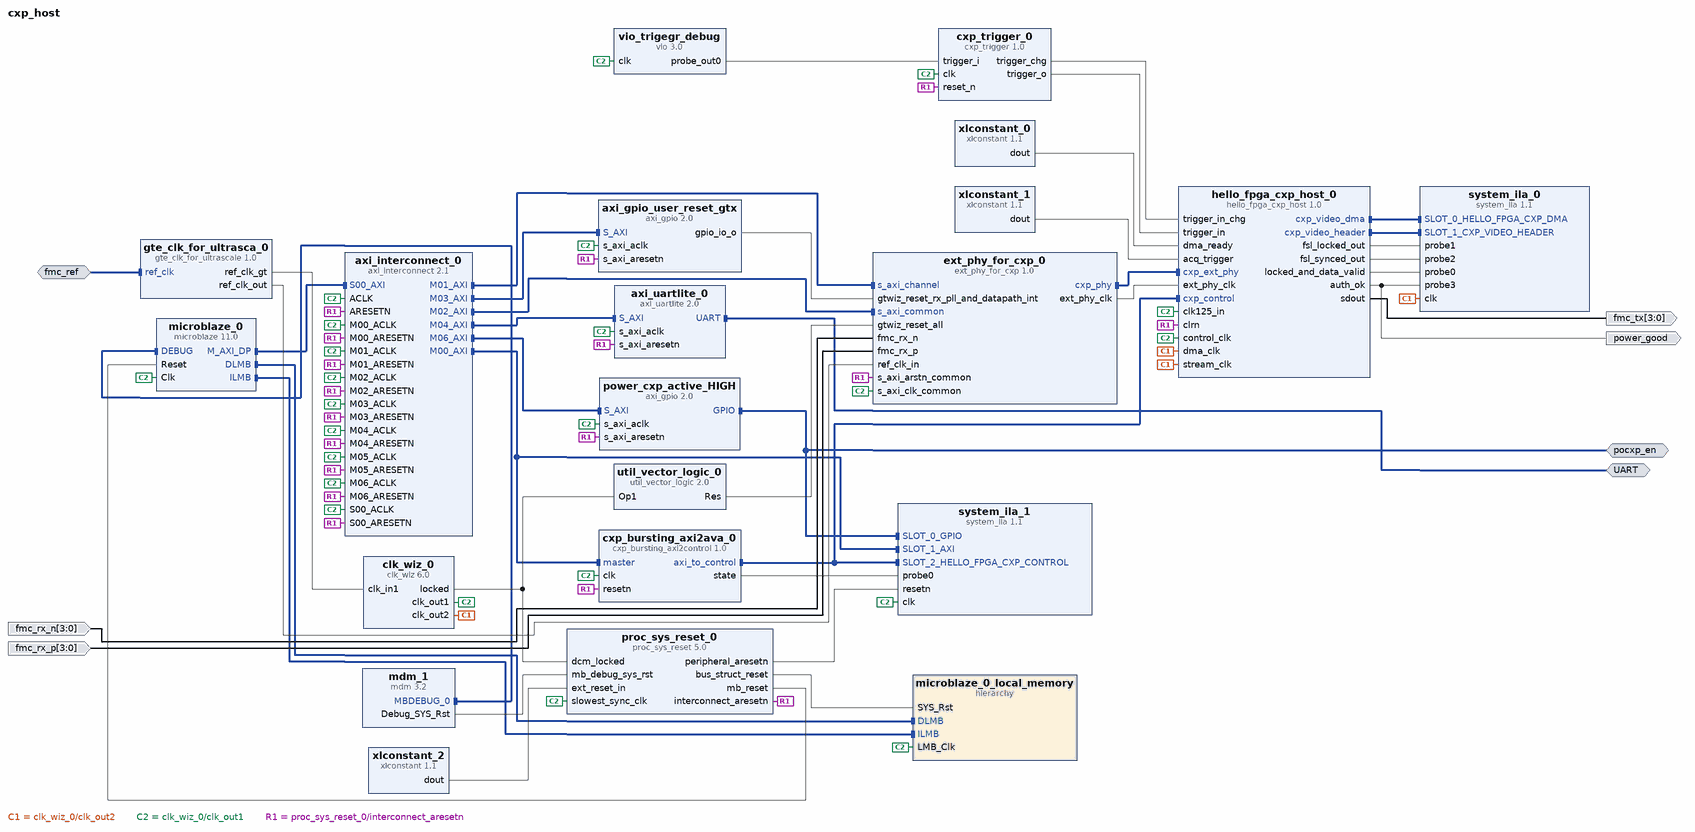
[diagram p0: block diagram of the top level]
# Vivado block design cxp_host, xcku060-ffva1156-2-i, Vivado 2019.1
create_bd_design cxp_host

create_bd_intf_port -mode Master -vlnv xilinx.com:interface:uart_rtl:1.0 UART
create_bd_intf_port -mode Slave -vlnv xilinx.com:interface:diff_clock_rtl:1.0 fmc_ref
create_bd_intf_port -mode Master -vlnv xilinx.com:interface:gpio_rtl:1.0 pocxp_en
create_bd_port -dir I -from 3 -to 0 fmc_rx_n
create_bd_port -dir I -from 3 -to 0 fmc_rx_p
create_bd_port -dir O -from 3 -to 0 fmc_tx
create_bd_port -dir O power_good

create_bd_cell -type hier microblaze_0_local_memory
create_bd_cell -type ip -vlnv xilinx.com:ip:axi_gpio:2.0 axi_gpio_user_reset_gtx
set_property -dict {CONFIG.C_ALL_OUTPUTS 1 CONFIG.C_GPIO_WIDTH 1} [get_bd_cells axi_gpio_user_reset_gtx]
create_bd_cell -type ip -vlnv xilinx.com:ip:axi_interconnect:2.1 axi_interconnect_0
set_property -dict {CONFIG.NUM_MI 7 CONFIG.S00_HAS_DATA_FIFO 0 CONFIG.STRATEGY 0} [get_bd_cells axi_interconnect_0]
create_bd_cell -type ip -vlnv xilinx.com:ip:axi_uartlite:2.0 axi_uartlite_0
set_property -dict [list \
  CONFIG.C_BAUDRATE 115200 \
  CONFIG.C_S_AXI_ACLK_FREQ_HZ 125000000 \
  CONFIG.UARTLITE_BOARD_INTERFACE Custom \
] [get_bd_cells axi_uartlite_0]
create_bd_cell -type ip -vlnv xilinx.com:ip:clk_wiz:6.0 clk_wiz_0
set_property -dict [list \
  CONFIG.CLKIN1_JITTER_PS 80.0 \
  CONFIG.CLKOUT1_JITTER 105.587 \
  CONFIG.CLKOUT1_PHASE_ERROR 83.589 \
  CONFIG.CLKOUT1_REQUESTED_OUT_FREQ 125 \
  CONFIG.CLKOUT2_JITTER 92.841 \
  CONFIG.CLKOUT2_PHASE_ERROR 83.589 \
  CONFIG.CLKOUT2_REQUESTED_OUT_FREQ 250 \
  CONFIG.CLKOUT2_USED true \
  CONFIG.CLKOUT3_JITTER 92.841 \
  CONFIG.CLKOUT3_PHASE_ERROR 83.589 \
  CONFIG.CLKOUT3_REQUESTED_OUT_FREQ 100.000 \
  CONFIG.CLKOUT3_USED false \
  CONFIG.MMCM_CLKFBOUT_MULT_F 8.000 \
  CONFIG.MMCM_CLKIN1_PERIOD 8.000 \
  CONFIG.MMCM_CLKIN2_PERIOD 10.000 \
  CONFIG.MMCM_CLKOUT0_DIVIDE_F 8.000 \
  CONFIG.MMCM_CLKOUT1_DIVIDE 4 \
  CONFIG.MMCM_CLKOUT2_DIVIDE 1 \
  CONFIG.MMCM_DIVCLK_DIVIDE 1 \
  CONFIG.NUM_OUT_CLKS 2 \
  CONFIG.PHASESHIFT_MODE LATENCY \
  CONFIG.PRIM_IN_FREQ 125.000 \
  CONFIG.USE_RESET false \
] [get_bd_cells clk_wiz_0]
create_bd_cell -type ip -vlnv Hello-FPGA:CXP:cxp_bursting_axi2control:1.0 cxp_bursting_axi2ava_0
set_property -dict {CONFIG.ADDRSIZE 16 CONFIG.BURSTSIZE 1 CONFIG.C_S_AXI_BURST_WIDTH 8} [get_bd_cells cxp_bursting_axi2ava_0]
create_bd_cell -type ip -vlnv Hello_FPGA:CXP:cxp_trigger:1.0 cxp_trigger_0
create_bd_cell -type ip -vlnv Hello_FPGA:CXP:gte_clk_for_ultrascale:1.0 gte_clk_for_ultrasca_0
create_bd_cell -type ip -vlnv xilinx.com:ip:mdm:3.2 mdm_1
create_bd_cell -type ip -vlnv xilinx.com:ip:microblaze:11.0 microblaze_0
set_property -dict [list \
  CONFIG.C_ADDR_TAG_BITS 0 \
  CONFIG.C_AREA_OPTIMIZED 0 \
  CONFIG.C_DCACHE_ADDR_TAG 0 \
  CONFIG.C_DEBUG_ENABLED 1 \
  CONFIG.C_D_AXI 1 \
  CONFIG.C_D_LMB 1 \
  CONFIG.C_I_LMB 1 \
  CONFIG.C_USE_BARREL 1 \
  CONFIG.C_USE_HW_MUL 1 \
  CONFIG.C_USE_MSR_INSTR 1 \
  CONFIG.C_USE_PCMP_INSTR 1 \
  CONFIG.C_USE_REORDER_INSTR 0 \
  CONFIG.G_TEMPLATE_LIST 8 \
] [get_bd_cells microblaze_0]
create_bd_cell -type ip -vlnv xilinx.com:ip:axi_gpio:2.0 power_cxp_active_HIGH
set_property -dict [list \
  CONFIG.C_ALL_OUTPUTS 1 \
  CONFIG.C_DOUT_DEFAULT 0x00000007 \
  CONFIG.C_GPIO_WIDTH 3 \
] [get_bd_cells power_cxp_active_HIGH]
create_bd_cell -type ip -vlnv xilinx.com:ip:proc_sys_reset:5.0 proc_sys_reset_0
create_bd_cell -type ip -vlnv xilinx.com:ip:system_ila:1.1 system_ila_0
set_property -dict [list \
  CONFIG.C_MON_TYPE MIX \
  CONFIG.C_NUM_MONITOR_SLOTS 2 \
  CONFIG.C_NUM_OF_PROBES 4 \
  CONFIG.C_SLOT 1 \
  CONFIG.C_SLOT_0_INTF_TYPE visn.intranet:user:hello_fpga_cxp_dma_rtl:1.0 \
  CONFIG.C_SLOT_0_TYPE 0 \
  CONFIG.C_SLOT_1_INTF_TYPE Hello_FPGA:CXP:cxp_video_header_rtl:1.0 \
] [get_bd_cells system_ila_0]
create_bd_cell -type ip -vlnv xilinx.com:ip:system_ila:1.1 system_ila_1
set_property -dict [list \
  CONFIG.C_MON_TYPE MIX \
  CONFIG.C_NUM_MONITOR_SLOTS 3 \
  CONFIG.C_NUM_OF_PROBES 1 \
  CONFIG.C_PROBE0_TYPE 0 \
  CONFIG.C_SLOT_0_INTF_TYPE xilinx.com:interface:gpio_rtl:1.0 \
  CONFIG.C_SLOT_0_TYPE 0 \
  CONFIG.C_SLOT_1_APC_EN 0 \
  CONFIG.C_SLOT_1_AXI_AR_SEL_DATA 1 \
  CONFIG.C_SLOT_1_AXI_AR_SEL_TRIG 1 \
  CONFIG.C_SLOT_1_AXI_AW_SEL_DATA 1 \
  CONFIG.C_SLOT_1_AXI_AW_SEL_TRIG 1 \
  CONFIG.C_SLOT_1_AXI_B_SEL_DATA 1 \
  CONFIG.C_SLOT_1_AXI_B_SEL_TRIG 1 \
  CONFIG.C_SLOT_1_AXI_R_SEL_DATA 1 \
  CONFIG.C_SLOT_1_AXI_R_SEL_TRIG 1 \
  CONFIG.C_SLOT_1_AXI_W_SEL_DATA 1 \
  CONFIG.C_SLOT_1_AXI_W_SEL_TRIG 1 \
  CONFIG.C_SLOT_1_INTF_TYPE xilinx.com:interface:aximm_rtl:1.0 \
  CONFIG.C_SLOT_2_INTF_TYPE visn.intranet:user:hello_fpga_cxp_control_rtl:1.0 \
  CONFIG.C_SLOT_2_TYPE 0 \
] [get_bd_cells system_ila_1]
create_bd_cell -type ip -vlnv xilinx.com:ip:util_vector_logic:2.0 util_vector_logic_0
set_property -dict {CONFIG.C_OPERATION not CONFIG.C_SIZE 1} [get_bd_cells util_vector_logic_0]
create_bd_cell -type ip -vlnv xilinx.com:ip:vio:3.0 vio_trigegr_debug
set_property -dict [list \
  CONFIG.C_NUM_PROBE_IN 0 \
  CONFIG.C_NUM_PROBE_OUT 1 \
  CONFIG.C_PROBE_OUT0_INIT_VAL 0x0 \
] [get_bd_cells vio_trigegr_debug]
create_bd_cell -type ip -vlnv xilinx.com:ip:xlconstant:1.1 xlconstant_0
create_bd_cell -type ip -vlnv xilinx.com:ip:xlconstant:1.1 xlconstant_1
create_bd_cell -type ip -vlnv xilinx.com:ip:xlconstant:1.1 xlconstant_2
create_bd_cell -type ip -vlnv Hello_FPGA:CXP:ext_phy_for_cxp:1.0 ext_phy_for_cxp_0
create_bd_cell -type ip -vlnv Hello_FPGA:CXP:hello_fpga_cxp_host:1.0 hello_fpga_cxp_host_0
set_property -dict [list \
  CONFIG.BIGENDIAN_EN 0 \
  CONFIG.CONTROL_CLK_FREQ 50000000 \
  CONFIG.DEVICE UltraScale \
  CONFIG.ENABLE_DNA_AUTH 0 \
  CONFIG.INDIRECT_REGS 1 \
  CONFIG.REGS_PER_LINK 0 \
  CONFIG.STREAM_BUFFER_BYTES 8192 \
  CONFIG.STREAM_WORDS 8 \
] [get_bd_cells hello_fpga_cxp_host_0]

# ---- hierarchy /microblaze_0_local_memory ----
current_bd_instance /microblaze_0_local_memory
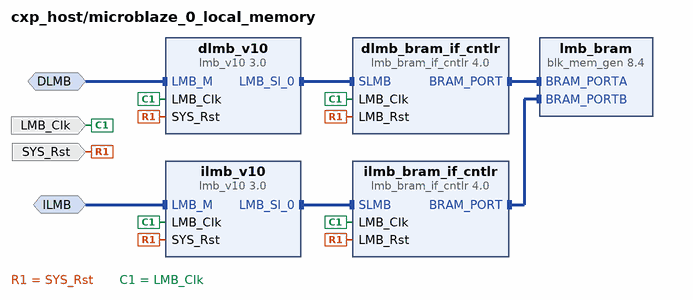
[diagram p1: block diagram inside /microblaze_0_local_memory]
create_bd_intf_pin -mode MirroredMaster -vlnv xilinx.com:interface:lmb_rtl:1.0 DLMB
create_bd_intf_pin -mode MirroredMaster -vlnv xilinx.com:interface:lmb_rtl:1.0 ILMB
create_bd_pin -dir I -type clk LMB_Clk
create_bd_pin -dir I -type rst SYS_Rst

create_bd_cell -type ip -vlnv xilinx.com:ip:lmb_bram_if_cntlr:4.0 dlmb_bram_if_cntlr
set_property -dict {CONFIG.C_ECC 0} [get_bd_cells dlmb_bram_if_cntlr]
create_bd_cell -type ip -vlnv xilinx.com:ip:lmb_v10:3.0 dlmb_v10
create_bd_cell -type ip -vlnv xilinx.com:ip:lmb_bram_if_cntlr:4.0 ilmb_bram_if_cntlr
set_property -dict {CONFIG.C_ECC 0} [get_bd_cells ilmb_bram_if_cntlr]
create_bd_cell -type ip -vlnv xilinx.com:ip:lmb_v10:3.0 ilmb_v10
create_bd_cell -type ip -vlnv xilinx.com:ip:blk_mem_gen:8.4 lmb_bram
set_property -dict [list \
  CONFIG.Enable_B Use_ENB_Pin \
  CONFIG.Memory_Type True_Dual_Port_RAM \
  CONFIG.Port_B_Clock 100 \
  CONFIG.Port_B_Enable_Rate 100 \
  CONFIG.Port_B_Write_Rate 50 \
  CONFIG.Use_RSTB_Pin true \
  CONFIG.use_bram_block BRAM_Controller \
] [get_bd_cells lmb_bram]

# ---- connections ----

current_bd_instance /microblaze_0_local_memory
connect_bd_intf_net -intf_net microblaze_0_dlmb_cntlr [get_bd_intf_pins dlmb_bram_if_cntlr/BRAM_PORT] [get_bd_intf_pins lmb_bram/BRAM_PORTA]
connect_bd_intf_net -intf_net microblaze_0_ilmb [get_bd_intf_pins ILMB] [get_bd_intf_pins ilmb_v10/LMB_M]
connect_bd_intf_net -intf_net microblaze_0_dlmb [get_bd_intf_pins DLMB] [get_bd_intf_pins dlmb_v10/LMB_M]
connect_bd_intf_net -intf_net microblaze_0_dlmb_bus [get_bd_intf_pins dlmb_bram_if_cntlr/SLMB] [get_bd_intf_pins dlmb_v10/LMB_Sl_0]
connect_bd_intf_net -intf_net microblaze_0_ilmb_cntlr [get_bd_intf_pins ilmb_bram_if_cntlr/BRAM_PORT] [get_bd_intf_pins lmb_bram/BRAM_PORTB]
connect_bd_intf_net -intf_net microblaze_0_ilmb_bus [get_bd_intf_pins ilmb_bram_if_cntlr/SLMB] [get_bd_intf_pins ilmb_v10/LMB_Sl_0]
connect_bd_net [get_bd_pins SYS_Rst] \
  [get_bd_pins dlmb_bram_if_cntlr/LMB_Rst] [get_bd_pins dlmb_v10/SYS_Rst] [get_bd_pins ilmb_bram_if_cntlr/LMB_Rst] \
  [get_bd_pins ilmb_v10/SYS_Rst]
connect_bd_net -net microblaze_0_Clk [get_bd_pins LMB_Clk] \
  [get_bd_pins dlmb_bram_if_cntlr/LMB_Clk] [get_bd_pins dlmb_v10/LMB_Clk] [get_bd_pins ilmb_bram_if_cntlr/LMB_Clk] \
  [get_bd_pins ilmb_v10/LMB_Clk]
set_property HDL_ATTRIBUTE.BMM_INFO_ADDRESS_SPACE {byte  0x00000000 32 > cxp_host microblaze_0_local_memory/lmb_bram} [get_bd_cells dlmb_bram_if_cntlr]
set_property HDL_ATTRIBUTE.KEEP_HIERARCHY yes [get_bd_cells dlmb_bram_if_cntlr]

current_bd_instance /
connect_bd_intf_net -intf_net hello_fpga_cxp_host_0_cxp_video_dma [get_bd_intf_pins hello_fpga_cxp_host_0/cxp_video_dma] [get_bd_intf_pins system_ila_0/SLOT_0_HELLO_FPGA_CXP_DMA]
connect_bd_intf_net [get_bd_intf_ports fmc_ref] [get_bd_intf_pins gte_clk_for_ultrasca_0/ref_clk]
connect_bd_intf_net [get_bd_intf_ports UART] [get_bd_intf_pins axi_uartlite_0/UART]
connect_bd_intf_net [get_bd_intf_pins axi_interconnect_0/M06_AXI] [get_bd_intf_pins power_cxp_active_HIGH/S_AXI]
connect_bd_intf_net [get_bd_intf_pins axi_interconnect_0/M01_AXI] [get_bd_intf_pins ext_phy_for_cxp_0/s_axi_channel]
connect_bd_intf_net -intf_net cxp_bursting_axi2ava_0_axi_to_control [get_bd_intf_pins cxp_bursting_axi2ava_0/axi_to_control] [get_bd_intf_pins hello_fpga_cxp_host_0/cxp_control]
connect_bd_intf_net [get_bd_intf_pins cxp_bursting_axi2ava_0/axi_to_control] [get_bd_intf_pins system_ila_1/SLOT_2_HELLO_FPGA_CXP_CONTROL]
connect_bd_intf_net -intf_net ext_phy_for_cxp_1_cxp_phy [get_bd_intf_pins ext_phy_for_cxp_0/cxp_phy] [get_bd_intf_pins hello_fpga_cxp_host_0/cxp_ext_phy]
connect_bd_intf_net [get_bd_intf_pins microblaze_0/DLMB] [get_bd_intf_pins microblaze_0_local_memory/DLMB]
connect_bd_intf_net -intf_net power_cxp_active_low_GPIO [get_bd_intf_ports pocxp_en] [get_bd_intf_pins power_cxp_active_HIGH/GPIO]
connect_bd_intf_net [get_bd_intf_ports pocxp_en] [get_bd_intf_pins system_ila_1/SLOT_0_GPIO]
connect_bd_intf_net [get_bd_intf_pins axi_interconnect_0/M02_AXI] [get_bd_intf_pins ext_phy_for_cxp_0/s_axi_common]
connect_bd_intf_net [get_bd_intf_pins axi_gpio_user_reset_gtx/S_AXI] [get_bd_intf_pins axi_interconnect_0/M03_AXI]
connect_bd_intf_net [get_bd_intf_pins microblaze_0/ILMB] [get_bd_intf_pins microblaze_0_local_memory/ILMB]
connect_bd_intf_net [get_bd_intf_pins mdm_1/MBDEBUG_0] [get_bd_intf_pins microblaze_0/DEBUG]
connect_bd_intf_net [get_bd_intf_pins axi_interconnect_0/S00_AXI] [get_bd_intf_pins microblaze_0/M_AXI_DP]
connect_bd_intf_net [get_bd_intf_pins axi_interconnect_0/M04_AXI] [get_bd_intf_pins axi_uartlite_0/S_AXI]
connect_bd_intf_net -intf_net axi_interconnect_0_M00_AXI [get_bd_intf_pins axi_interconnect_0/M00_AXI] [get_bd_intf_pins cxp_bursting_axi2ava_0/master]
connect_bd_intf_net [get_bd_intf_pins axi_interconnect_0/M00_AXI] [get_bd_intf_pins system_ila_1/SLOT_1_AXI]
connect_bd_intf_net [get_bd_intf_pins hello_fpga_cxp_host_0/cxp_video_header] [get_bd_intf_pins system_ila_0/SLOT_1_CXP_VIDEO_HEADER]
connect_bd_net [get_bd_pins axi_gpio_user_reset_gtx/gpio_io_o] [get_bd_pins ext_phy_for_cxp_0/gtwiz_reset_rx_pll_and_datapath_int]
connect_bd_net [get_bd_pins clk_wiz_0/clk_out2] \
  [get_bd_pins system_ila_0/clk] [get_bd_pins hello_fpga_cxp_host_0/stream_clk] [get_bd_pins hello_fpga_cxp_host_0/dma_clk]
connect_bd_net [get_bd_pins clk_wiz_0/locked] [get_bd_pins proc_sys_reset_0/dcm_locked] [get_bd_pins util_vector_logic_0/Op1]
connect_bd_net [get_bd_pins cxp_trigger_0/trigger_chg] [get_bd_pins hello_fpga_cxp_host_0/trigger_in_chg]
connect_bd_net [get_bd_pins cxp_trigger_0/trigger_o] [get_bd_pins hello_fpga_cxp_host_0/trigger_in]
connect_bd_net -net ext_phy_for_cxp_1_ext_phy_clk [get_bd_pins ext_phy_for_cxp_0/ext_phy_clk] [get_bd_pins hello_fpga_cxp_host_0/ext_phy_clk]
connect_bd_net [get_bd_ports fmc_rx_n] [get_bd_pins ext_phy_for_cxp_0/fmc_rx_n]
connect_bd_net [get_bd_ports fmc_rx_p] [get_bd_pins ext_phy_for_cxp_0/fmc_rx_p]
connect_bd_net [get_bd_pins gte_clk_for_ultrasca_0/ref_clk_gt] [get_bd_pins clk_wiz_0/clk_in1]
connect_bd_net [get_bd_pins gte_clk_for_ultrasca_0/ref_clk_out] [get_bd_pins ext_phy_for_cxp_0/ref_clk_in]
connect_bd_net [get_bd_pins hello_fpga_cxp_host_0/auth_ok] [get_bd_ports power_good] [get_bd_pins system_ila_0/probe3]
connect_bd_net [get_bd_pins hello_fpga_cxp_host_0/fsl_locked_out] [get_bd_pins system_ila_0/probe1]
connect_bd_net [get_bd_pins hello_fpga_cxp_host_0/fsl_synced_out] [get_bd_pins system_ila_0/probe2]
connect_bd_net [get_bd_pins hello_fpga_cxp_host_0/locked_and_data_valid] [get_bd_pins system_ila_0/probe0]
connect_bd_net [get_bd_pins hello_fpga_cxp_host_0/sdout] [get_bd_ports fmc_tx]
connect_bd_net [get_bd_pins mdm_1/Debug_SYS_Rst] [get_bd_pins proc_sys_reset_0/mb_debug_sys_rst]
connect_bd_net -net microblaze_0_Clk [get_bd_pins clk_wiz_0/clk_out1] \
  [get_bd_pins microblaze_0_local_memory/LMB_Clk] [get_bd_pins axi_gpio_user_reset_gtx/s_axi_aclk] \
  [get_bd_pins axi_interconnect_0/ACLK] [get_bd_pins axi_interconnect_0/S00_ACLK] [get_bd_pins axi_interconnect_0/M00_ACLK] \
  [get_bd_pins axi_interconnect_0/M01_ACLK] [get_bd_pins axi_interconnect_0/M02_ACLK] \
  [get_bd_pins axi_interconnect_0/M03_ACLK] [get_bd_pins axi_interconnect_0/M04_ACLK] \
  [get_bd_pins axi_interconnect_0/M05_ACLK] [get_bd_pins axi_interconnect_0/M06_ACLK] [get_bd_pins axi_uartlite_0/s_axi_aclk] \
  [get_bd_pins cxp_bursting_axi2ava_0/clk] [get_bd_pins cxp_trigger_0/clk] [get_bd_pins microblaze_0/Clk] \
  [get_bd_pins power_cxp_active_HIGH/s_axi_aclk] [get_bd_pins proc_sys_reset_0/slowest_sync_clk] \
  [get_bd_pins system_ila_1/clk] [get_bd_pins vio_trigegr_debug/clk] [get_bd_pins ext_phy_for_cxp_0/s_axi_clk_common] \
  [get_bd_pins hello_fpga_cxp_host_0/clk125_in] [get_bd_pins hello_fpga_cxp_host_0/control_clk]
connect_bd_net -net proc_sys_reset_1_interconnect_aresetn [get_bd_pins proc_sys_reset_0/interconnect_aresetn] \
  [get_bd_pins axi_gpio_user_reset_gtx/s_axi_aresetn] [get_bd_pins axi_interconnect_0/ARESETN] \
  [get_bd_pins axi_interconnect_0/S00_ARESETN] [get_bd_pins axi_interconnect_0/M00_ARESETN] \
  [get_bd_pins axi_interconnect_0/M01_ARESETN] [get_bd_pins axi_interconnect_0/M02_ARESETN] \
  [get_bd_pins axi_interconnect_0/M03_ARESETN] [get_bd_pins axi_interconnect_0/M04_ARESETN] \
  [get_bd_pins axi_interconnect_0/M05_ARESETN] [get_bd_pins axi_interconnect_0/M06_ARESETN] \
  [get_bd_pins axi_uartlite_0/s_axi_aresetn] [get_bd_pins cxp_bursting_axi2ava_0/resetn] [get_bd_pins cxp_trigger_0/reset_n] \
  [get_bd_pins power_cxp_active_HIGH/s_axi_aresetn] [get_bd_pins ext_phy_for_cxp_0/s_axi_arstn_common] \
  [get_bd_pins hello_fpga_cxp_host_0/clrn]
connect_bd_net -net rst_clk_wiz_0_125M_mb_reset [get_bd_pins proc_sys_reset_0/mb_reset] [get_bd_pins microblaze_0/Reset]
connect_bd_net [get_bd_pins util_vector_logic_0/Res] [get_bd_pins ext_phy_for_cxp_0/gtwiz_reset_all]
connect_bd_net [get_bd_pins xlconstant_0/dout] [get_bd_pins hello_fpga_cxp_host_0/dma_ready]
connect_bd_net [get_bd_pins xlconstant_1/dout] [get_bd_pins hello_fpga_cxp_host_0/acq_trigger]
connect_bd_net [get_bd_pins proc_sys_reset_0/bus_struct_reset] [get_bd_pins microblaze_0_local_memory/SYS_Rst]
connect_bd_net -net vio_reset_debug_probe_out1 [get_bd_pins vio_trigegr_debug/probe_out0] [get_bd_pins cxp_trigger_0/trigger_i]
connect_bd_net [get_bd_pins proc_sys_reset_0/peripheral_aresetn] [get_bd_pins system_ila_1/resetn]
connect_bd_net -net state [get_bd_pins cxp_bursting_axi2ava_0/state] [get_bd_pins system_ila_1/probe0]
connect_bd_net [get_bd_pins xlconstant_2/dout] [get_bd_pins proc_sys_reset_0/ext_reset_in]
set_property HDL_ATTRIBUTE.BMM_INFO_PROCESSOR {microblaze-le > cxp_host microblaze_0_local_memory/dlmb_bram_if_cntlr} [get_bd_cells microblaze_0]
set_property HDL_ATTRIBUTE.KEEP_HIERARCHY yes [get_bd_cells microblaze_0]
set_property HDL_ATTRIBUTE.DEBUG true [get_bd_intf_nets hello_fpga_cxp_host_0_cxp_video_dma]
set_property HDL_ATTRIBUTE.MARK_DEBUG true [get_bd_intf_nets hello_fpga_cxp_host_0_cxp_video_dma]
set_property HDL_ATTRIBUTE.DEBUG true [get_bd_intf_nets cxp_bursting_axi2ava_0_axi_to_control]
set_property HDL_ATTRIBUTE.MARK_DEBUG true [get_bd_intf_nets cxp_bursting_axi2ava_0_axi_to_control]
set_property HDL_ATTRIBUTE.DEBUG true [get_bd_intf_nets axi_interconnect_0_M00_AXI]
set_property HDL_ATTRIBUTE.MARK_DEBUG true [get_bd_intf_nets axi_interconnect_0_M00_AXI]
set_property HDL_ATTRIBUTE.DEBUG true [get_bd_nets state]
set_property HDL_ATTRIBUTE.MARK_DEBUG true [get_bd_nets state]

# ---- address map ----
assign_bd_address -offset 0x00000000 -range 128K -target_address_space [get_bd_addr_spaces microblaze_0/Data] [get_bd_addr_segs microblaze_0_local_memory/dlmb_bram_if_cntlr/SLMB/Mem]
assign_bd_address -offset 0x40000000 -range 64K -target_address_space [get_bd_addr_spaces microblaze_0/Data] [get_bd_addr_segs power_cxp_active_HIGH/S_AXI/Reg]
assign_bd_address -offset 0x40600000 -range 64K -target_address_space [get_bd_addr_spaces microblaze_0/Data] [get_bd_addr_segs axi_uartlite_0/S_AXI/Reg]
assign_bd_address -offset 0x44A00000 -range 64K -target_address_space [get_bd_addr_spaces microblaze_0/Data] [get_bd_addr_segs ext_phy_for_cxp_0/s_axi_channel/reg0]
assign_bd_address -offset 0x44A10000 -range 64K -target_address_space [get_bd_addr_spaces microblaze_0/Data] [get_bd_addr_segs ext_phy_for_cxp_0/s_axi_common/reg0]
assign_bd_address -offset 0x44A20000 -range 64K -target_address_space [get_bd_addr_spaces microblaze_0/Data] [get_bd_addr_segs axi_gpio_user_reset_gtx/S_AXI/Reg]
assign_bd_address -offset 0x44A30000 -range 64K -target_address_space [get_bd_addr_spaces microblaze_0/Data] [get_bd_addr_segs cxp_bursting_axi2ava_0/master/reg0]
assign_bd_address -offset 0x00000000 -range 128K -target_address_space [get_bd_addr_spaces microblaze_0/Instruction] [get_bd_addr_segs microblaze_0_local_memory/ilmb_bram_if_cntlr/SLMB/Mem]

validate_bd_design
save_bd_design
